# Altium schematic sheet Misaka-v1.0.SchDoc (part 1 of 2)
size 629 x 400 mm
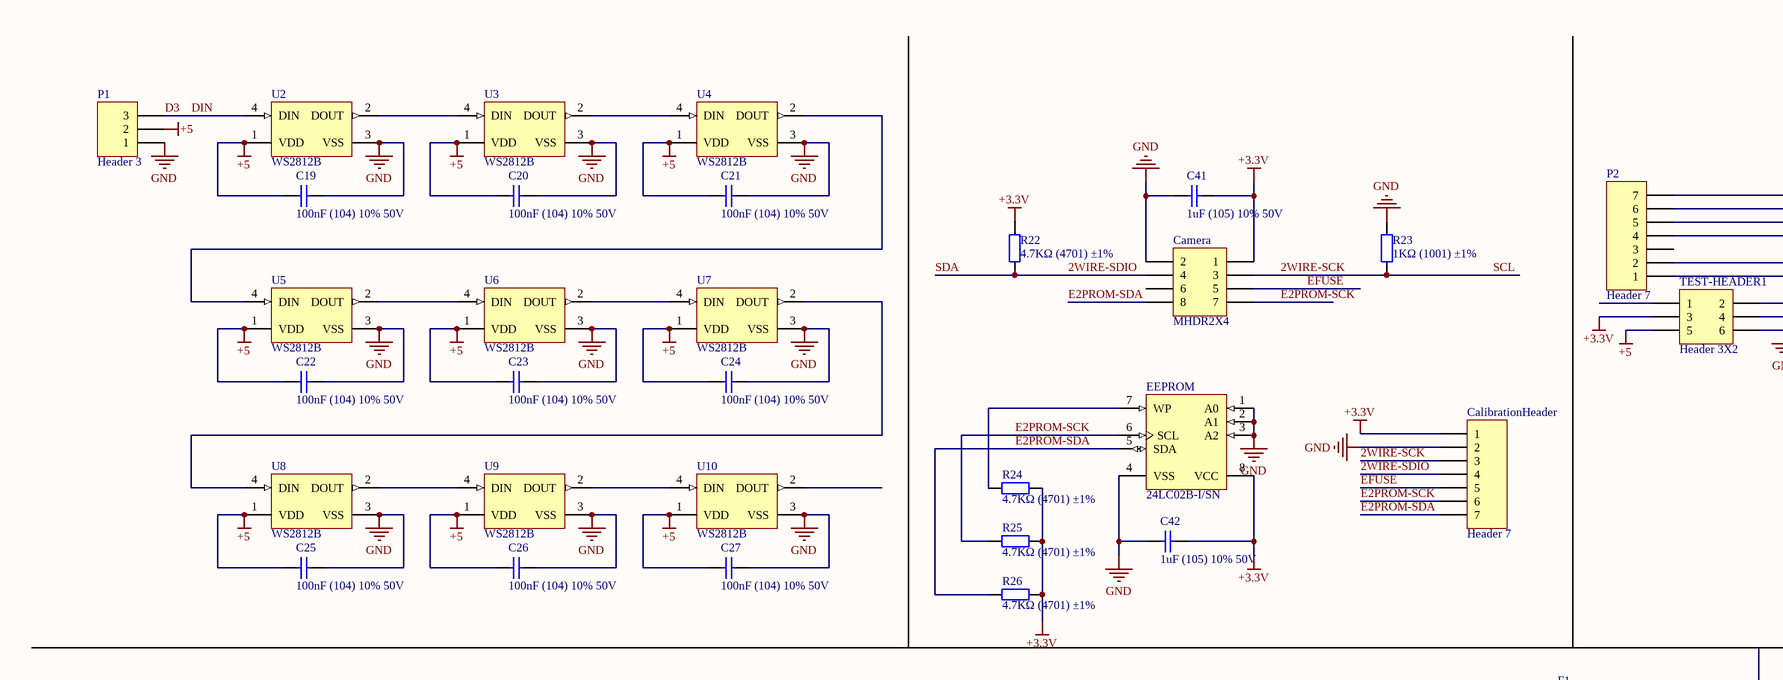
[diagram p0: Misaka-v1.0.SchDoc, top left]
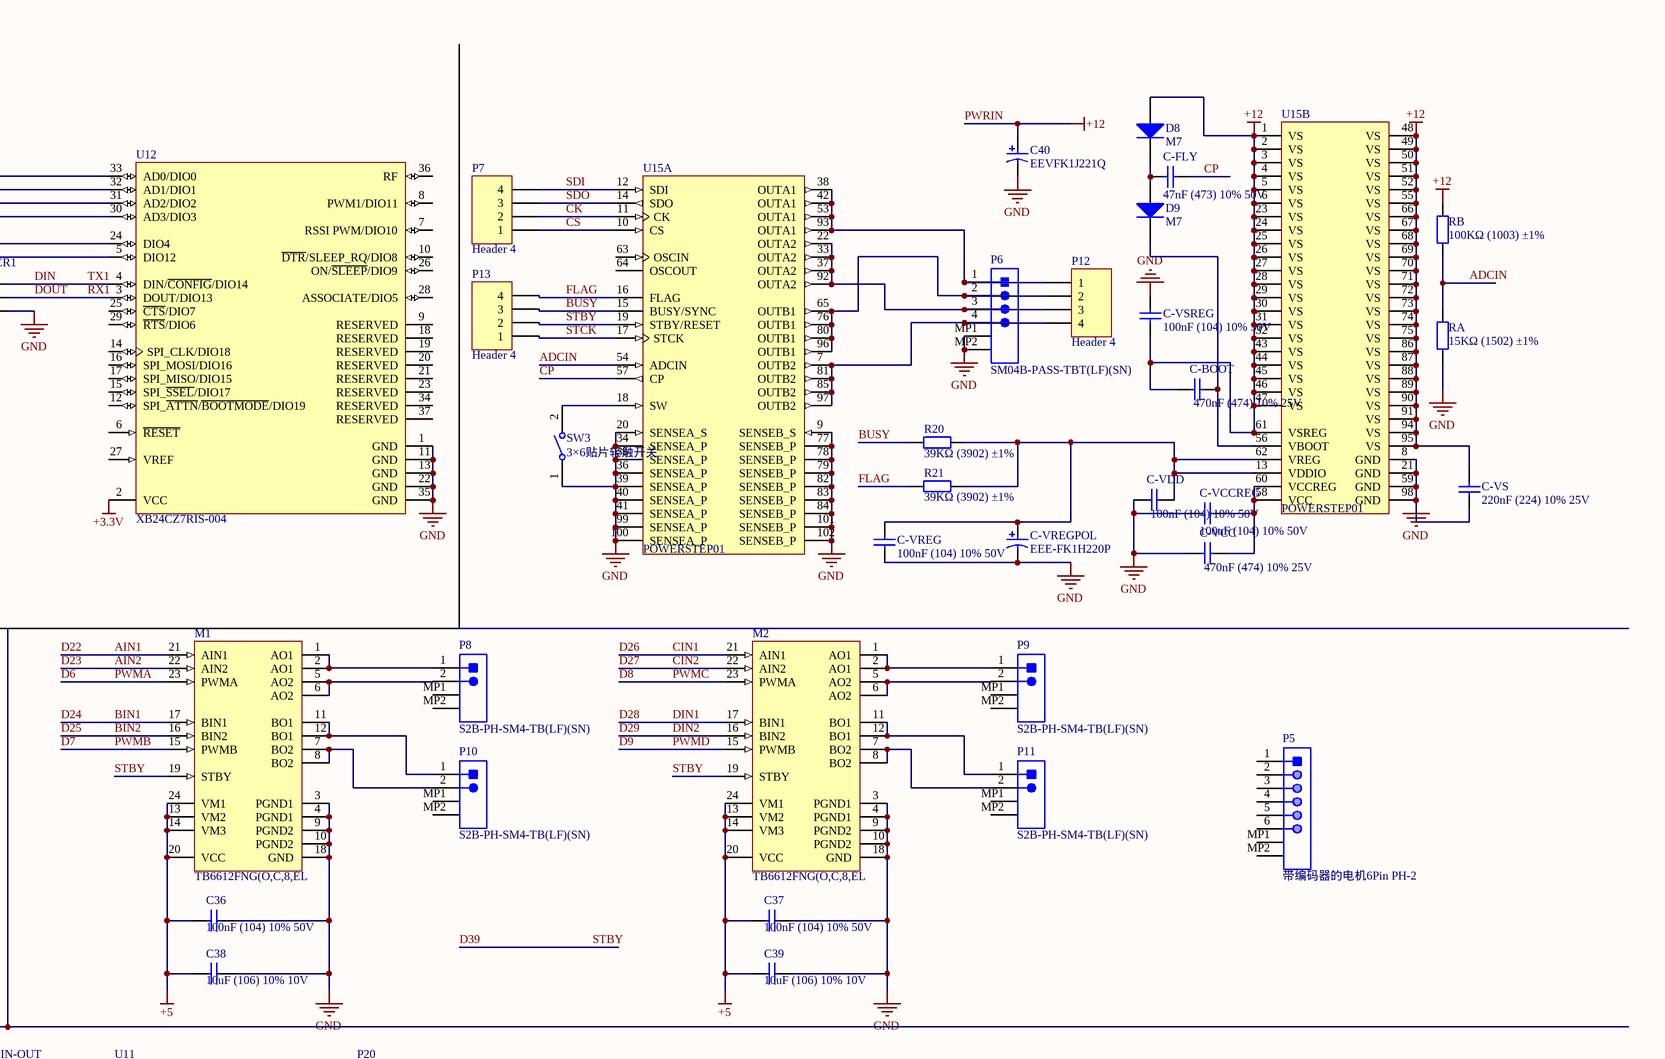
[diagram p1: Misaka-v1.0.SchDoc, top right]
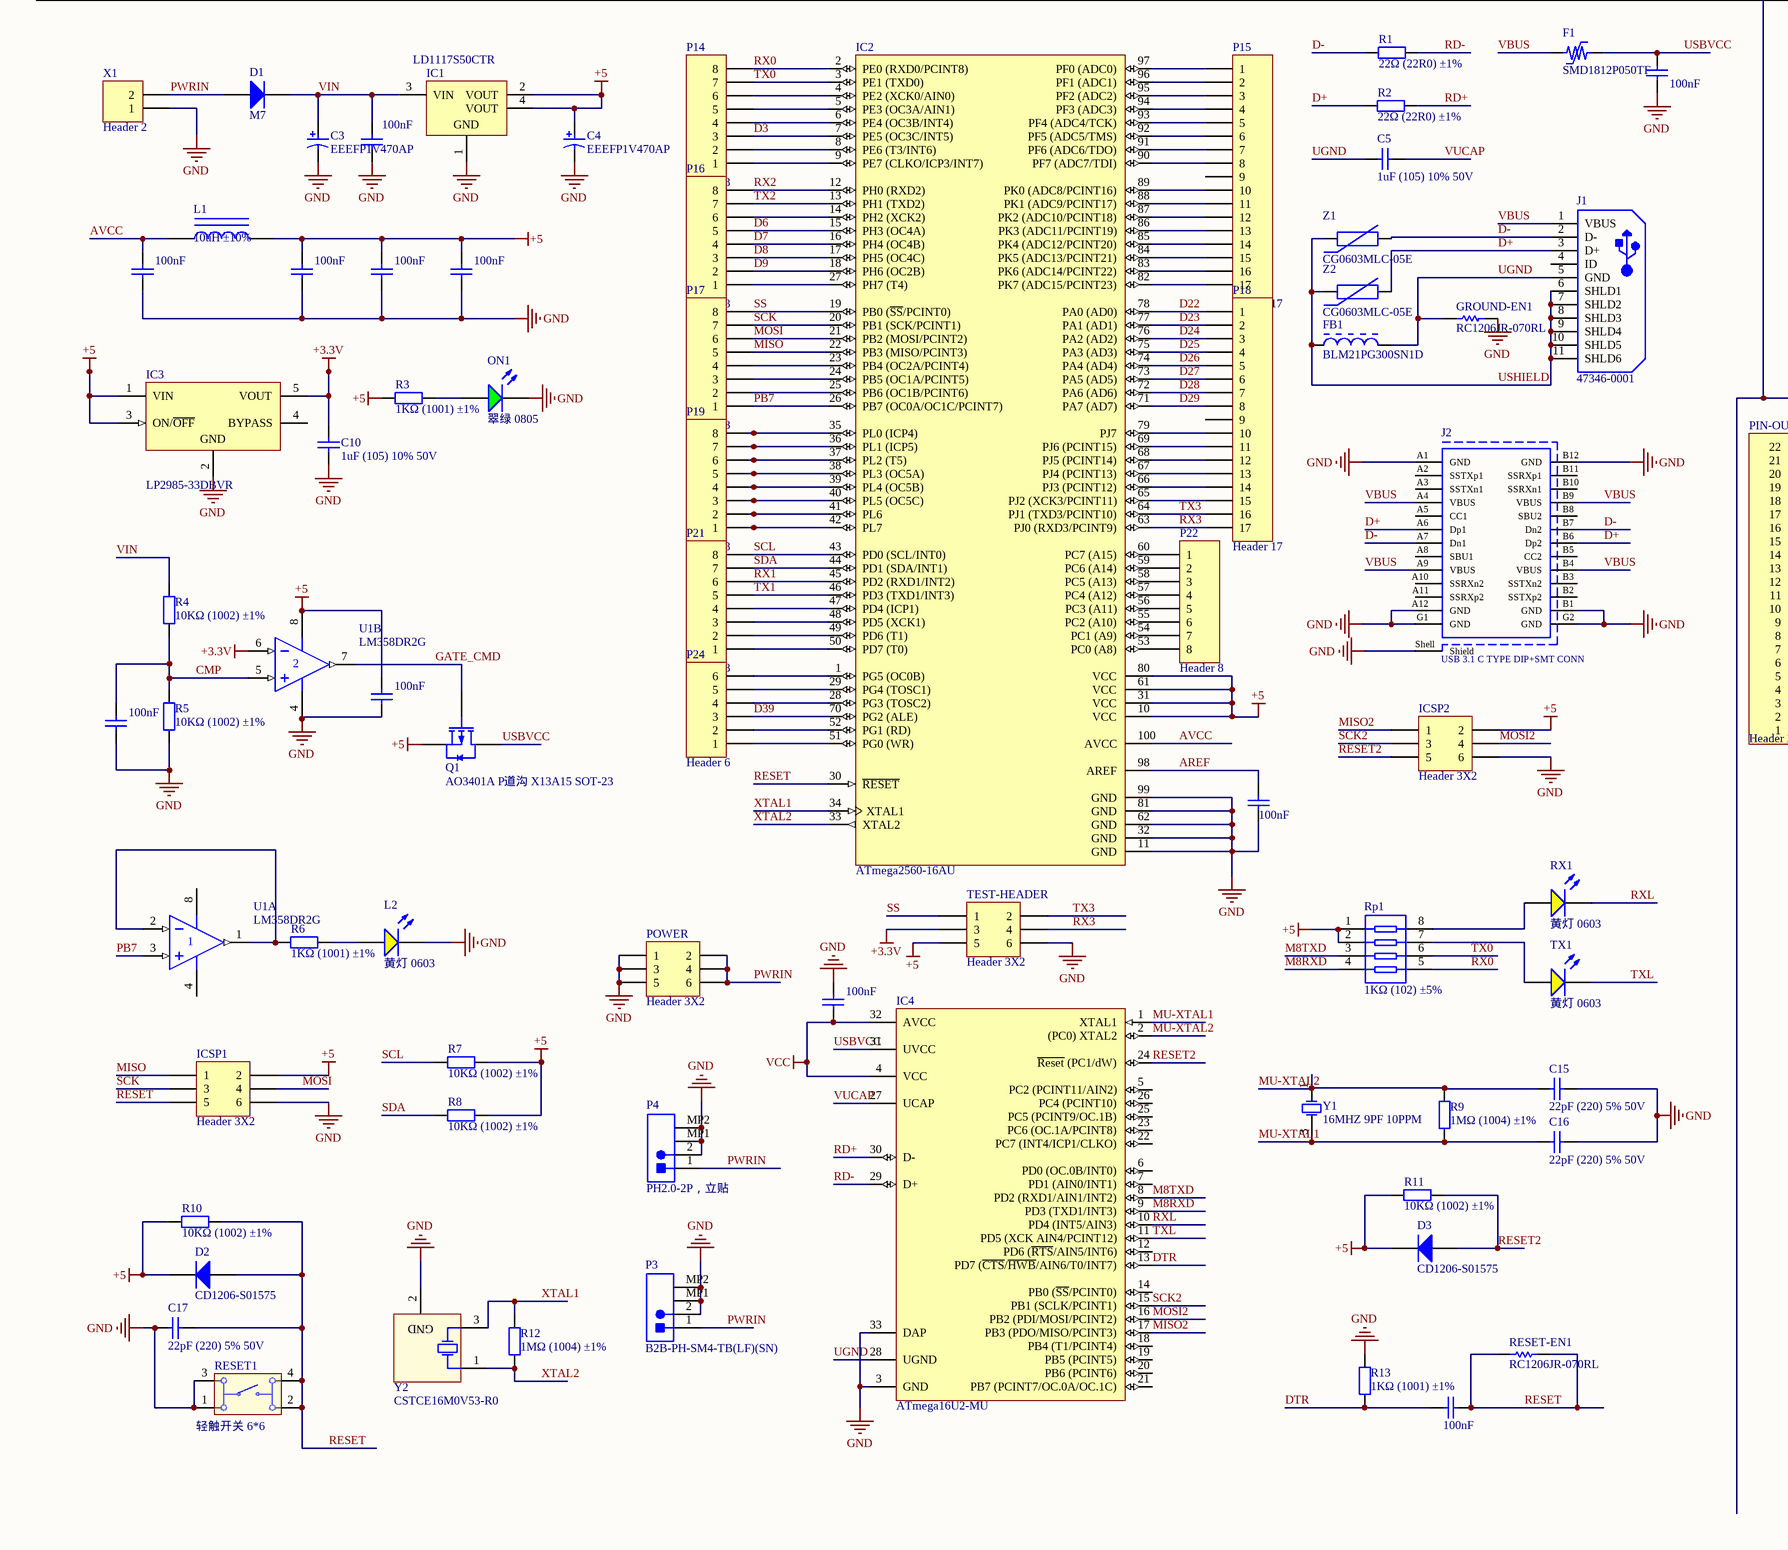
[diagram p2: Misaka-v1.0.SchDoc, bottom left]
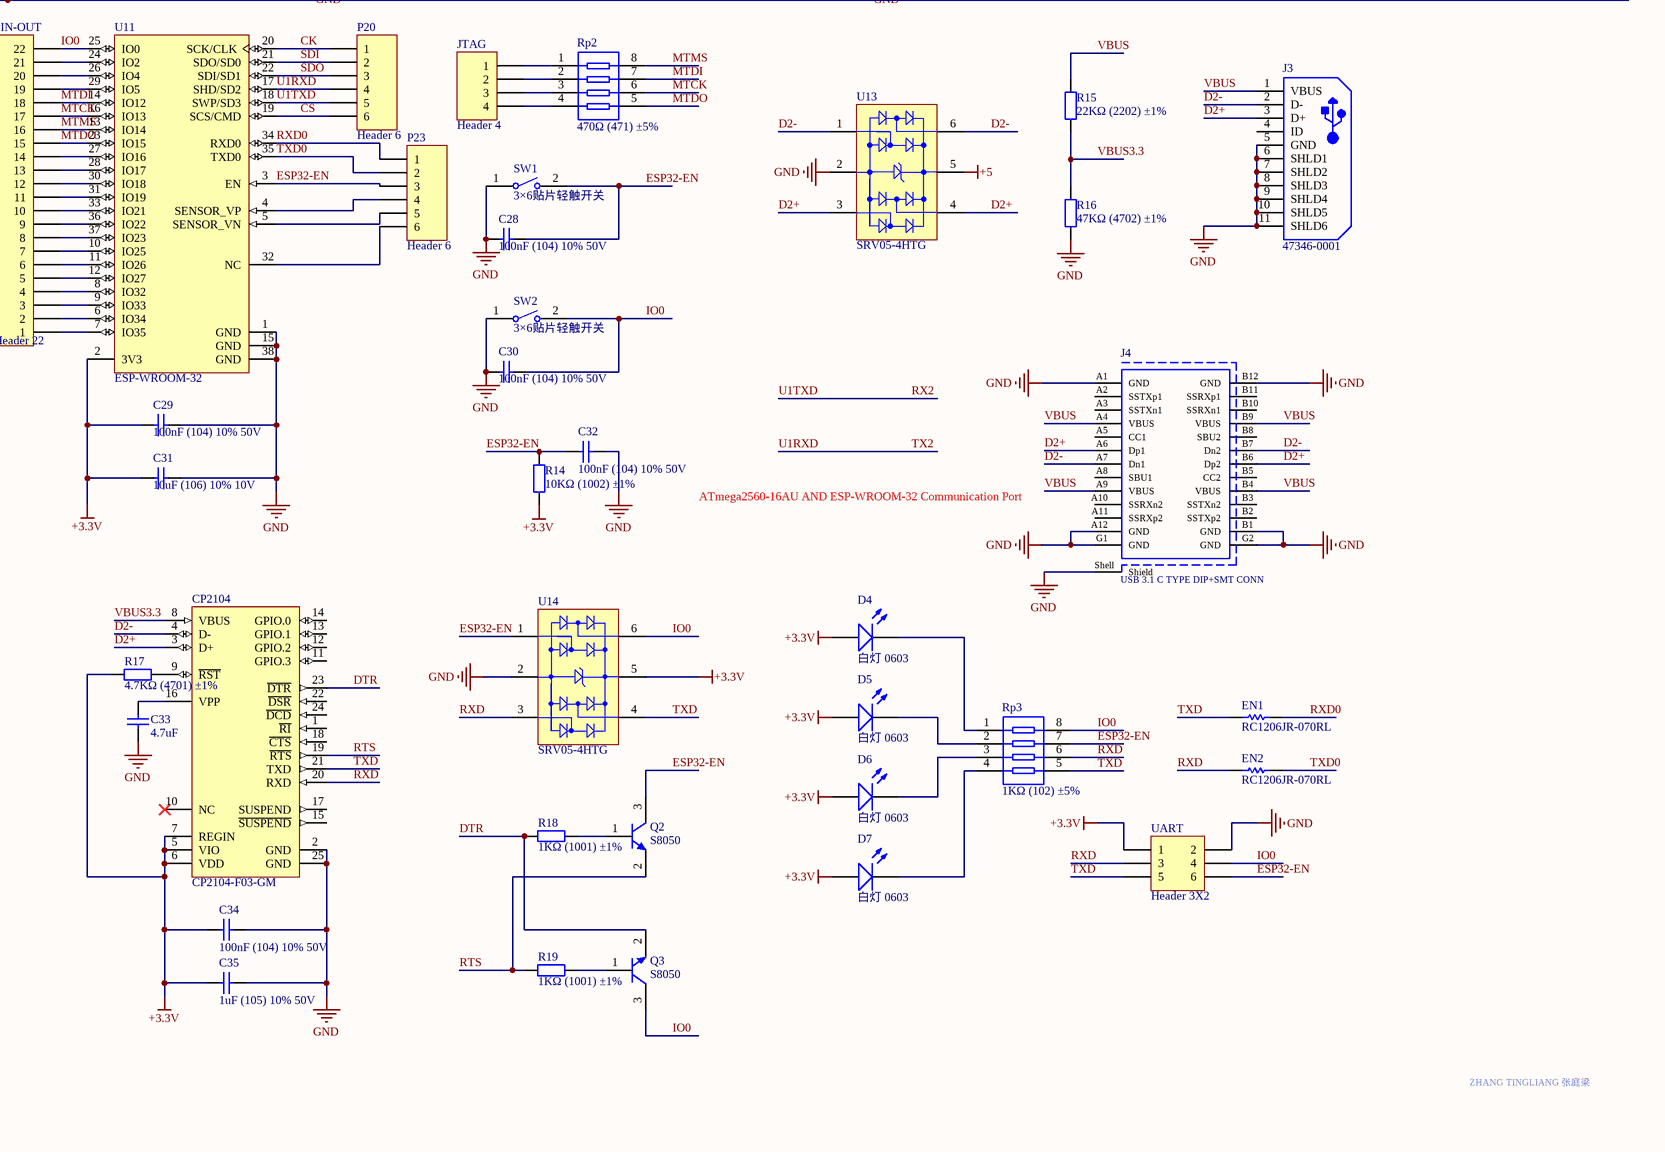
[diagram p3: Misaka-v1.0.SchDoc, bottom right]

## Parts
C1  100nF  [0603_C]
C2  100nF  [0603_C]
C3  EEEFP1V470AP  [PNSC-FP-V-D_V]
C4  EEEFP1V470AP  [PNSC-FP-V-D_V]
C5  1uF (105) 10% 50V  [0603_C]
C6  100nF  [0603_C]
C7  100nF  [0603_C]
C8  100nF  [0603_C]
C9  100nF  [0603_C]
C10  1uF (105) 10% 50V  [0603_C]
C11  100nF  [0603_C]
C12  100nF  [0603_C]
C13  100nF  [0603_C]
C14  100nF  [0603_C]
C15  22pF (220) 5% 50V  [0603_C]
C16  22pF (220) 5% 50V  [0603_C]
C17  22pF (220) 5% 50V  [0603_C]
C18  100nF  [0603_C]
C19  100nF (104) 10% 50V  [0603_C]
C20  100nF (104) 10% 50V  [0603_C]
C21  100nF (104) 10% 50V  [0603_C]
C22  100nF (104) 10% 50V  [0603_C]
C23  100nF (104) 10% 50V  [0603_C]
C24  100nF (104) 10% 50V  [0603_C]
C25  100nF (104) 10% 50V  [0603_C]
C26  100nF (104) 10% 50V  [0603_C]
C27  100nF (104) 10% 50V  [0603_C]
C28  100nF (104) 10% 50V  [0603_C]
C29  100nF (104) 10% 50V  [0603_C]
C30  100nF (104) 10% 50V  [0603_C]
C31  10uF (106) 10% 10V  [0603_C]
C32  100nF (104) 10% 50V  [0603_C]
C33  4.7uF  [0603_C]
C34  100nF (104) 10% 50V  [0603_C]
C35  1uF (105) 10% 50V  [0603_C]
C36  100nF (104) 10% 50V  [0603_C]
C37  100nF (104) 10% 50V  [0603_C]
C38  10uF (106) 10% 10V  [0603_C]
C39  10uF (106) 10% 10V  [0603_C]
C40  EEVFK1J221Q  [PNSC-FK-V-H13_V]
C41  1uF (105) 10% 50V  [0603_C]
C42  1uF (105) 10% 50V  [0603_C]
C-BOOT  470nF (474) 10% 25V  [0603_C]
C-FLY  47nF (473) 10% 50V  [0603_C]
C-VCC  470nF (474) 10% 25V  [0603_C]
C-VCCREG  100nF (104) 10% 50V  [0603_C]
C-VDD  100nF (104) 10% 50V  [0603_C]
C-VREG  100nF (104) 10% 50V  [0603_C]
C-VREGPOL  EEE-FK1H220P  [PNSC-EEE-FK1H220P_L]
C-VS  220nF (224) 10% 25V  [0603_C]
C-VSREG  100nF (104) 10% 50V  [0603_C]
CalibrationHeader  Header 7  [HDR1X7]
Camera  MHDR2X4  [MHDR2X4]
CP2104  CP2104-F03-GM  [SLAB-QFN-24-2675x2675TP_M]
D1  M7  [SMA(DO-214AC)_S1]
D2  CD1206-S01575  [BOUR-CD1206-S01575-2_L]
D3  CD1206-S01575  [BOUR-CD1206-S01575-2_L]
D4  白灯 0603  [0603_LED_S1]
D5  白灯 0603  [0603_LED_S1]
D6  白灯 0603  [0603_LED_S1]
D7  白灯 0603  [0603_LED_S1]
D8  M7  [SMA(DO-214AC)_S1]
D9  M7  [SMA(DO-214AC)_S1]
EEPROM  24LC02B-I/SN  [SOIC-SN8_N]
EN1  RC1206JR-070RL  [RESC3116X65X40ML10T20]
EN2  RC1206JR-070RL  [RESC3116X65X40ML10T20]
F1  SMD1812P050TF  [BOUR-MF-MSMF050-2_V]
FB1  BLM21PG300SN1D  [MURA-BLM21-B40-CHIP-2_V2]
GROUND-EN1  RC1206JR-070RL  [RESC3116X65X40ML10T20]
IC1  LD1117S50CTR  [SOT-223_N]
IC2  ATmega2560-16AU  [100A_M]
IC3  LP2985-33DBVR  [DBV0005A_M]
IC4  ATmega16U2-MU  [32PG_N]
ICSP1  Header 3X2  [HDR2X3]
ICSP2  Header 3X2  [HDR2X3]
J1  47346-0001  [MOLX-47346-0001-5_V]
J2  USB 3.1 C TYPE DIP+SMT CONN  [632723100011]
J3  47346-0001  [MOLX-47346-0001-5_V]
J4  USB 3.1 C TYPE DIP+SMT CONN  [632723100011]
JTAG  Header 4  [HDR1X4]
L1  10uH ±10%  [0603_L]
L2  黄灯 0603  [0603_LED_S1]
M1  TB6612FNG(O,C,8,EL  [TOSH-SSOP24-P-300-0.65A_M]
M2  TB6612FNG(O,C,8,EL  [TOSH-SSOP24-P-300-0.65A_M]
ON1  翠绿 0805  [0805_LED_S1]
P1  Header 3  [HDR1X3]
P2  Header 7  [HDR1X7]
P3  B2B-PH-SM4-TB(LF)(SN)  [JST-B2B-PH-SM4-TB-2_V]
P4  PH2.0-2P，立贴  [JST-B2B-PH-SM4-TB-2_V]
P5  带编码器的电机6Pin PH-2  [JST-S6B-PH-SM4-TB(LF)(SN)_V]
P6  SM04B-PASS-TBT(LF)(SN)  [JST-SM04B-PASS-TBT(LF)(SN)_V]
P7  Header 4  [HDR1X4]
P8  S2B-PH-SM4-TB(LF)(SN)  [JST- S2B-PH-SM4-TB(LF)(SN)-2_V]
P9  S2B-PH-SM4-TB(LF)(SN)  [JST- S2B-PH-SM4-TB(LF)(SN)-2_V]
P10  S2B-PH-SM4-TB(LF)(SN)  [JST- S2B-PH-SM4-TB(LF)(SN)-2_V]
P11  S2B-PH-SM4-TB(LF)(SN)  [JST- S2B-PH-SM4-TB(LF)(SN)-2_V]
P12  Header 4  [HDR1X4]
P13  Header 4  [HDR1X4]
P14  Header 8  [HDR1X8]
P15  Header 17  [HDR1X17]
P16  Header 8  [HDR1X8]
P17  Header 8  [HDR1X8]
P18  Header 17  [HDR1X17]
P19  Header 8  [HDR1X8]
P20  Header 6  [HDR1X6]
P21  Header 8  [HDR1X8]
P22  Header 8  [HDR1X8]
P23  Header 6  [HDR1X6]
P24  Header 6  [HDR1X6]
PIN-OUT  Header 22  [HDR1X22]
POWER  Header 3X2  [HDR2X3]
Q1  AO3401A P道沟 X13A15 SOT-23  [SOT-23-3L]
Q2  S8050  [ONSC-SOT-23-3-318-08_V]
Q3  S8050  [ONSC-SOT-23-3-318-08_V]
R1  22Ω (22R0) ±1%  [0603_R]
R2  22Ω (22R0) ±1%  [0603_R]
R3  1KΩ (1001) ±1%  [0603_R]
R4  10KΩ (1002) ±1%  [0603_R]
R5  10KΩ (1002) ±1%  [0603_R]
R6  1KΩ (1001) ±1%  [0603_R]
R7  10KΩ (1002) ±1%  [0603_R]
R8  10KΩ (1002) ±1%  [0603_R]
R9  1MΩ (1004) ±1%  [0603_R]
R10  10KΩ (1002) ±1%  [0603_R]
R11  10KΩ (1002) ±1%  [0603_R]
R12  1MΩ (1004) ±1%  [0603_R]
R13  1KΩ (1001) ±1%  [0603_R]
R14  10KΩ (1002) ±1%  [0603_R]
R15  22KΩ (2202) ±1%  [0603_R]
R16  47KΩ (4702) ±1%  [0603_R]
R17  4.7KΩ (4701) ±1%  [0603_R]
R18  1KΩ (1001) ±1%  [0603_R]
R19  1KΩ (1001) ±1%  [0603_R]
R20  39KΩ (3902) ±1%  [0603_R]
R21  39KΩ (3902) ±1%  [0603_R]
R22  4.7KΩ (4701) ±1%  [0603_R]
R23  1KΩ (1001) ±1%  [0603_R]
R24  4.7KΩ (4701) ±1%  [0603_R]
R25  4.7KΩ (4701) ±1%  [0603_R]
R26  4.7KΩ (4701) ±1%  [0603_R]
RA  15KΩ (1502) ±1%  [0603_R]
RB  100KΩ (1003) ±1%  [0603_R]
RESET1  轻触开关 6*6  [430152043836]
RESET-EN1  RC1206JR-070RL  [RESC3116X65X40ML10T20]
Rp1  1KΩ (102) ±5%  [0603_Rx4]
Rp2  470Ω (471) ±5%  [0603_Rx4]
Rp3  1KΩ (102) ±5%  [0603_Rx4]
RX1  黄灯 0603  [0603_LED_S1]
SW1  3×6贴片轻触开关  [TECO-FSMSM-2_V]
SW2  3×6贴片轻触开关  [TECO-FSMSM-2_V]
SW3  3×6贴片轻触开关  [TECO-FSMSM-2_V]
TEST-HEADER  Header 3X2  [HDR2X3]
TEST-HEADER1  Header 3X2  [HDR2X3]
TX1  黄灯 0603  [0603_LED_S1]
U1  LM358DR2G  [SOIC-8_150mil]  (parts A,B of 2)
U2  WS2812B  [ADA-RGB-1655_V]
U3  WS2812B  [ADA-RGB-1655_V]
U4  WS2812B  [ADA-RGB-1655_V]
U5  WS2812B  [ADA-RGB-1655_V]
U6  WS2812B  [ADA-RGB-1655_V]
U7  WS2812B  [ADA-RGB-1655_V]
U8  WS2812B  [ADA-RGB-1655_V]
U9  WS2812B  [ADA-RGB-1655_V]
U10  WS2812B  [ADA-RGB-1655_V]
U11  ESP-WROOM-32  [OLMX-ESP-WROOM-32]
U12  XB24CZ7RIS-004  [DIGI-XB24CZ7RIS-004-Module-37_V]
U13  SRV05-4HTG  [LFUS-SOT23-6_V]
U14  SRV05-4HTG  [LFUS-SOT23-6_V]
U15  POWERSTEP01  [STM-VFQFPN-102_V]  (parts A,B of 2)
UART  Header 3X2  [HDR2X3]
X1  Header 2  [HDR1X2]
Y1  16MHZ 9PF 10PPM  [SMD-3225_4P]
Y2  CSTCE16M0V53-R0  [MURA-CSTCE_V-3_V]
Z1  CG0603MLC-05E  [BOUR-CG0603-2_V]
Z2  CG0603MLC-05E  [BOUR-CG0603-2_V]

## Nets
+3.3V: C10.2 C29.1 C31.1 C34.1 C35.1 C41.2 C42.2 CalibrationHeader.1 Camera.1 CP2104.5(VIO) CP2104.6(VDD) CP2104.7(REGIN) D4.A D5.A D6.A D7.A EEPROM.8(VCC) IC3.5(VOUT) R14.1 R17.2 R22.2 R24.2 R25.2 R26.2 TEST-HEADER.3 TEST-HEADER1.3 U1.6(IN-) U11.2(3V3) U12.2(VCC) U14.5(VCC) UART.1
+5: C4.1 C7.1 C8.1 C9.1 C11.1 C19.1 C20.1 C21.1 C22.1 C23.1 C24.1 C25.1 C26.1 C27.1 C36.1 C37.1 C38.1 C39.1 D2.2(K) D3.2(K) IC1.2(VOUT) IC1.4(VOUT) IC2.10(VCC) IC2.31(VCC) IC2.61(VCC) IC2.80(VCC) IC3.1(VIN) IC3.3(ON/~{OFF}) ICSP1.2 ICSP2.2 L1.2 M1.13(VM2) M1.14(VM3) M1.20(VCC) M1.24(VM1) M2.13(VM2) M2.14(VM3) M2.20(VCC) M2.24(VM1) P1.2 Q1.2(S) R3.1 R7.1 R8.1 R10.2 R11.2 Rp1.1 Rp1.2 TEST-HEADER.5 TEST-HEADER1.5 U1.8(V+) U2.1(VDD) U3.1(VDD) U4.1(VDD) U5.1(VDD) U6.1(VDD) U7.1(VDD) U8.1(VDD) U9.1(VDD) U10.1(VDD) U13.5(VCC)
GND: C1.1 C2.2 C3.2 C4.2 C6.2 C7.2 C8.2 C9.2 C10.1 C11.2 C12.2 C13.2 C14.1 C15.1 C16.2 C17.1 C19.2 C20.2 C21.2 C22.2 C23.2 C24.2 C25.2 C26.2 C27.2 C28.1 C29.2 C30.1 C31.2 C32.2 C33.1 C34.2 C35.2 C36.2 C37.2 C38.2 C39.2 C40.2 C41.1 C42.1 C-VCC.1 C-VCCREG.1 C-VDD.1 C-VREG.1 C-VREGPOL.2 C-VS.1 C-VSREG.2 CalibrationHeader.2 Camera.2 CP2104.2(GND) CP2104.25(GND) EEPROM.1(A0) EEPROM.2(A1) EEPROM.3(A2) EEPROM.4(VSS) GROUND-EN1.2 IC1.1(GND) IC2.11(GND) IC2.32(GND) IC2.62(GND) IC2.81(GND) IC2.99(GND) IC3.2(GND) IC4.3(GND) IC4.33(DAP) ICSP1.6 ICSP2.6 J2.A1(GND) J2.A12(GND) J2.B1(GND) J2.B12(GND) J2.G1(GND) J2.G2(GND) J2.Shell(Shield) J3.5(GND) J3.6(SHLD1) J3.7(SHLD2) J3.8(SHLD3) J3.9(SHLD4) J3.10(SHLD5) J3.11(SHLD6) J4.A1(GND) J4.A12(GND) J4.B1(GND) J4.B12(GND) J4.G1(GND) J4.G2(GND) J4.Shell(Shield) L2.K M1.3(PGND1) M1.4(PGND1) M1.9(PGND2) M1.10(PGND2) M1.18(GND) M2.3(PGND1) M2.4(PGND1) M2.9(PGND2) M2.10(PGND2) M2.18(GND) ON1.K P1.1 P3.2 P3.MP1 P3.MP2 P4.2 P4.MP1 P4.MP2 P6.MP1 P6.MP2 POWER.1 POWER.3 POWER.5 R5.1 R13.1 R16.1 R23.2 RA.1 RESET1.1 RESET1.3 SW1.1 SW2.1 SW3.1 TEST-HEADER.6 TEST-HEADER1.6 U1.4(V-) U2.3(VSS) U3.3(VSS) U4.3(VSS) U5.3(VSS) U6.3(VSS) U7.3(VSS) U8.3(VSS) U9.3(VSS) U10.3(VSS) U11.1(GND) U11.15(GND) U11.38(GND) U12.1(GND) U12.11(GND) U12.13(GND) U12.22(GND) U12.35(GND) U13.2(GND) U14.2(GND) U15.8(GND) U15.9(SENSEB_S) U15.20(SENSEA_S) U15.21(GND) U15.34(SENSEA_P) U15.35(SENSEA_P) U15.36(SENSEA_P) U15.39(SENSEA_P) U15.40(SENSEA_P) U15.41(SENSEA_P) U15.59(GND) U15.77(SENSEB_P) U15.78(SENSEB_P) U15.79(SENSEB_P) U15.82(SENSEB_P) U15.83(SENSEB_P) U15.84(SENSEB_P) U15.98(GND) U15.99(SENSEA_P) U15.100(SENSEA_P) U15.101(SENSEB_P) U15.102(SENSEB_P) UART.2 X1.1 Y2.2(GND)
PWRIN: C40.1 C-BOOT.1 C-VS.2 C-VSREG.1 D1.1(A) D8.1(A) P3.1 P4.1 POWER.2 POWER.4 POWER.6 RB.2 U15.1(VS) U15.2(VS) U15.3(VS) U15.4(VS) U15.5(VS) U15.6(VS) U15.23(VS) U15.24(VS) U15.25(VS) U15.26(VS) U15.27(VS) U15.28(VS) U15.29(VS) U15.30(VS) U15.31(VS) U15.32(VS) U15.43(VS) U15.44(VS) U15.45(VS) U15.46(VS) U15.47(VS) U15.48(VS) U15.49(VS) U15.50(VS) U15.51(VS) U15.52(VS) U15.55(VS) U15.61(VSREG) U15.66(VS) U15.67(VS) U15.68(VS) U15.69(VS) U15.70(VS) U15.71(VS) U15.72(VS) U15.73(VS) U15.74(VS) U15.75(VS) U15.86(VS) U15.87(VS) U15.88(VS) U15.89(VS) U15.90(VS) U15.91(VS) U15.94(VS) U15.95(VS) X1.2  [also labelled +12]
VCC: C14.2 IC4.4(VCC) IC4.32(AVCC)
2WIRE-SCK: CalibrationHeader.3 Camera.3 IC2.43(PD0_(SCL/INT0)) P21.8 R7.2 R23.1  [also labelled SCL]
2WIRE-SDIO: CalibrationHeader.4 Camera.4 IC2.44(PD1_(SDA/INT1)) P21.7 R8.2 R22.1  [also labelled SDA]
ADCIN: RA.2 RB.1 U15.54(ADCIN)
AIN1: IC2.78(PA0_(AD0)) M1.21(AIN1) P18.1  [also labelled D22]
AIN2: IC2.77(PA1_(AD1)) M1.22(AIN2) P18.2  [also labelled D23]
AREF: C13.1 IC2.98(AREF)
AVCC: C6.1 IC2.100(AVCC) L1.1
BIN1: IC2.76(PA2_(AD2)) M1.17(BIN1) P18.3  [also labelled D24]
BIN2: IC2.75(PA3_(AD3)) M1.16(BIN2) P18.4  [also labelled D25]
BUSY: P13.3 R20.1 U15.15(BUSY/SYNC)
CIN1: IC2.74(PA4_(AD4)) M2.21(AIN1) P18.5  [also labelled D26]
CIN2: IC2.73(PA5_(AD5)) M2.22(AIN2) P18.6  [also labelled D27]
CK: P7.2 P20.1 U11.20(SCK/CLK) U15.11(CK)
CMP: C12.1 R4.1 R5.2 U1.5(IN+)
CP: C-FLY.2 U15.57(CP)
CS: P7.1 P20.6 U11.19(SCS/CMD) U15.10(CS)
D2+: CP2104.3(D+) J3.3(D+) J4.A6(Dp1) J4.B6(Dp2) U13.3(I/O_2) U13.4(I/O_3)
D2-: CP2104.4(D-) J3.2(D-) J4.A7(Dn1) J4.B7(Dn2) U13.1(I/O_1) U13.6(I/O_4)
D3: IC2.7(PE5_(OC3C/INT5)) IC2.46(PD3_(TXD1/INT3)) P1.3 P14.3 P21.5 TEST-HEADER1.2 U2.4(DIN) U12.4(DIN/~{CONFIG}/DIO14)  [also labelled DIN, TX1]
D6: IC2.15(PH3_(OC4A)) M1.23(PWMA) P16.5  [also labelled PWMA]
D7: IC2.16(PH4_(OC4B)) M1.15(PWMB) P16.4  [also labelled PWMB]
D8: IC2.17(PH5_(OC4C)) M2.23(PWMA) P16.3  [also labelled PWMC]
D9: IC2.18(PH6_(OC2B)) M2.15(PWMB) P16.2  [also labelled PWMD]
D28: IC2.72(PA6_(AD6)) M2.17(BIN1) P18.7  [also labelled DIN1]
D29: IC2.71(PA7_(AD7)) M2.16(BIN2) P18.8  [also labelled DIN2]
D39: IC2.70(PG2_(ALE)) M1.19(STBY) M2.19(STBY) P13.2 P24.3 U15.19(STBY/RESET)  [also labelled STBY]
D+: J1.3(D+) J2.A6(Dp1) J2.B6(Dp2) R2.1 Z2.2
D-: J1.2(D-) J2.A7(Dn1) J2.B7(Dn2) R1.1 Z1.2
DOUT: IC2.45(PD2_(RXD1/INT2)) P21.6 TEST-HEADER1.4 U12.3(DOUT/DIO13)  [also labelled RX1]
DTR: C18.1 CP2104.23(~{DTR}) IC4.13(PD7_(~{CTS}/~{HWB}/AIN6/T0/INT7)) Q3.2(E) R13.2 R18.1
E2PROM-SCK: CalibrationHeader.6 Camera.7 EEPROM.6(SCL) R25.1
E2PROM-SDA: CalibrationHeader.7 Camera.8 EEPROM.5(SDA) R26.1
EFUSE: CalibrationHeader.5 Camera.5
ESP32-EN: C28.2 C32.1 P23.3 Q2.3(C) R14.2 Rp3.7 SW1.2 U11.3(EN) U14.1(I/O_1) UART.6
FLAG: P13.4 R21.1 U15.16(FLAG)
GATE_CMD: Q1.1(G) U1.7(OUT)
IO0: C30.2 PIN-OUT.22 Q3.3(C) Rp3.8 SW2.2 U11.25(IO0) U14.6(I/O_4) UART.4
M8RXD: IC4.9(PD3_(TXD1/INT3)) Rp1.4
M8TXD: IC4.8(PD2_(RXD1/AIN1/INT2)) Rp1.3
MISO: IC2.22(PB3_(MISO/PCINT3)) ICSP1.1 P17.5
MISO2: IC4.17(PB3_(PDO/MISO/PCINT3)) ICSP2.1
MOSI: IC2.21(PB2_(MOSI/PCINT2)) ICSP1.4 P17.6
MOSI2: IC4.16(PB2_(PDI/MOSI/PCINT2)) ICSP2.4
MTCK: PIN-OUT.17 Rp2.6 U11.16(IO13)
MTDI: PIN-OUT.18 Rp2.7 U11.14(IO12)
MTDO: PIN-OUT.15 Rp2.5 U11.23(IO15)
MTMS: PIN-OUT.16 Rp2.8 U11.13(IO14)
MU-XTAL1: C16.1 IC4.1(XTAL1) R9.2 Y1.3(OSC2)
MU-XTAL2: C15.2 IC4.2((PC0)_XTAL2) R9.1 Y1.1(OSC1)
PB7: IC2.26(PB7_(OC0A/OC1C/PCINT7)) P17.1 U1.3(IN+)
RD+: IC4.30(D-) R2.2
RD-: IC4.29(D+) R1.2
RESET: C17.2 C18.2 D2.1(A) IC2.30(~{RESET}) ICSP1.5 R10.1 RESET1.2 RESET1.4 RESET-EN1.1 RESET-EN1.2
RESET2: D3.1(A) IC4.24(~{Reset}_(PC1/dW)) ICSP2.5 R11.1
RTS: CP2104.19(~{RTS}) Q2.2(E) R19.1
RX0: IC2.2(PE0_(RXD0/PCINT8)) P14.8 Rp1.5
RX2: IC2.12(PH0_(RXD2)) P16.8 P20.5 U11.18(SWP/SD3)  [also labelled U1TXD]
RX3: IC2.63(PJ0_(RXD3/PCINT9)) P18.17 TEST-HEADER.4
RXD: CP2104.20(RXD) EN2.1 Rp3.6 U14.3(I/O_2) UART.3
RXD0: EN1.2 P23.1 U11.34(RXD0)
RXL: IC4.10(PD4_(INT5/AIN3)) RX1.K
SCK: IC2.20(PB1_(SCK/PCINT1)) ICSP1.3 P17.7
SCK2: IC4.15(PB1_(SCLK/PCINT1)) ICSP2.3
SDI: P7.4 P20.2 U11.21(SDO/SD0) U15.12(SDI)
SDO: P7.3 P20.3 U11.22(SDI/SD1) U15.14(SDO)
SS: IC2.19(PB0_(~{SS}/PCINT0)) P17.8 TEST-HEADER.1
STCK: P13.1 U15.17(STCK)
TX0: IC2.3(PE1_(TXD0)) P14.7 Rp1.6
TX2: IC2.13(PH1_(TXD2)) P16.7 P20.4 U11.17(SHD/SD2)  [also labelled U1RXD]
TX3: IC2.64(PJ1_(TXD3/PCINT10)) P18.16 TEST-HEADER.2
TXD: CP2104.21(TXD) EN1.1 Rp3.5 U14.4(I/O_3) UART.5
TXD0: EN2.2 P23.2 U11.35(TXD0)
TXL: IC4.11(PD5_(XCK_AIN4/PCINT12)) TX1.K
UGND: C5.2 FB1.2 GROUND-EN1.1 IC4.28(UGND) J1.5(GND)
USBVCC: C1.2 F1.2 IC4.31(UVCC) Q1.3(D)
USHIELD: FB1.1 J1.6(SHLD1) J1.7(SHLD2) J1.8(SHLD3) J1.9(SHLD4) J1.10(SHLD5) J1.11(SHLD6) Z1.1 Z2.1
VBUS: F1.1 J1.1(VBUS) J2.A4(VBUS) J2.A9(VBUS) J2.B4(VBUS) J2.B9(VBUS) J3.1(VBUS) J4.A4(VBUS) J4.A9(VBUS) J4.B4(VBUS) J4.B9(VBUS) R15.2
VBUS3.3: CP2104.8(VBUS) R15.1 R16.2
VIN: C2.1 C3.1 D1.2(K) IC1.3(VIN) R4.2
VUCAP: C5.1 IC4.27(UCAP)
XTAL1: IC2.34(XTAL1) R12.2 Y2.3(C2)
XTAL2: IC2.33(XTAL2) R12.1 Y2.1(C1)
NetC33_2: C33.2 CP2104.16(VPP)
NetC-BOOT_2: C-BOOT.2 D9.2(K) U15.56(VBOOT)
NetC-FLY_1: C-FLY.1 D8.2(K) D9.1(A)
NetC-VCC_2: C-VCC.2 C-VCCREG.2 U15.58(VCC) U15.60(VCCREG)
NetC-VDD_2: C-VDD.2 C-VREG.2 C-VREGPOL.1 R20.2 R21.2 U15.13(VDDIO) U15.62(VREG)
NetCP2104_9: CP2104.9(~{RST}) R17.1
NetD4_K: D4.K Rp3.1
NetD5_K: D5.K Rp3.2
NetD6_K: D6.K Rp3.3
NetD7_K: D7.K Rp3.4
NetEEPROM_7: EEPROM.7(WP) R24.1
NetIC2_1: IC2.1(PG5_(OC0B)) P24.6
NetIC2_4: IC2.4(PE2_(XCK0/AIN0)) P14.6
NetIC2_5: IC2.5(PE3_(OC3A/AIN1)) P14.5
NetIC2_6: IC2.6(PE4_(OC3B/INT4)) P14.4
NetIC2_8: IC2.8(PE6_(T3/INT6)) P14.2
NetIC2_9: IC2.9(PE7_(CLKO/ICP3/INT7)) P14.1
NetIC2_14: IC2.14(PH2_(XCK2)) P16.6
NetIC2_23: IC2.23(PB4_(OC2A/PCINT4)) P17.4
NetIC2_24: IC2.24(PB5_(OC1A/PCINT5)) P17.3
NetIC2_25: IC2.25(PB6_(OC1B/PCINT6)) P17.2
NetIC2_27: IC2.27(PH7_(T4)) P16.1
NetIC2_28: IC2.28(PG3_(TOSC2)) P24.4
NetIC2_29: IC2.29(PG4_(TOSC1)) P24.5
NetIC2_35: IC2.35(PL0_(ICP4)) P19.8
NetIC2_36: IC2.36(PL1_(ICP5)) P19.7
NetIC2_37: IC2.37(PL2_(T5)) P19.6
NetIC2_38: IC2.38(PL3_(OC5A)) P19.5
NetIC2_39: IC2.39(PL4_(OC5B)) P19.4
NetIC2_40: IC2.40(PL5_(OC5C)) P19.3
NetIC2_41: IC2.41(PL6) P19.2
NetIC2_42: IC2.42(PL7) P19.1
NetIC2_47: IC2.47(PD4_(ICP1)) P21.4
NetIC2_48: IC2.48(PD5_(XCK1)) P21.3
NetIC2_49: IC2.49(PD6_(T1)) P21.2
NetIC2_50: IC2.50(PD7_(T0)) P21.1
NetIC2_51: IC2.51(PG0_(WR)) P24.1
NetIC2_52: IC2.52(PG1_(RD)) P24.2
NetIC2_53: IC2.53(PC0_(A8)) P22.8
NetIC2_54: IC2.54(PC1_(A9)) P22.7
NetIC2_55: IC2.55(PC2_(A10)) P22.6
NetIC2_56: IC2.56(PC3_(A11)) P22.5
NetIC2_57: IC2.57(PC4_(A12)) P22.4
NetIC2_58: IC2.58(PC5_(A13)) P22.3
NetIC2_59: IC2.59(PC6_(A14)) P22.2
NetIC2_60: IC2.60(PC7_(A15)) P22.1
NetIC2_65: IC2.65(PJ2_(XCK3/PCINT11)) P18.15
NetIC2_66: IC2.66(PJ3_(PCINT12)) P18.14
NetIC2_67: IC2.67(PJ4_(PCINT13)) P18.13
NetIC2_68: IC2.68(PJ5_(PCINT14)) P18.12
NetIC2_69: IC2.69(PJ6_(PCINT15)) P18.11
NetIC2_79: IC2.79(PJ7) P18.10
NetIC2_82: IC2.82(PK7_(ADC15/PCINT23)) P15.17
NetIC2_83: IC2.83(PK6_(ADC14/PCINT22)) P15.16
NetIC2_84: IC2.84(PK5_(ADC13/PCINT21)) P15.15
NetIC2_85: IC2.85(PK4_(ADC12/PCINT20)) P15.14
NetIC2_86: IC2.86(PK3_(ADC11/PCINT19)) P15.13
NetIC2_87: IC2.87(PK2_(ADC10/PCINT18)) P15.12
NetIC2_88: IC2.88(PK1_(ADC9/PCINT17)) P15.11
NetIC2_89: IC2.89(PK0_(ADC8/PCINT16)) P15.10
NetIC2_90: IC2.90(PF7_(ADC7/TDI)) P15.8
NetIC2_91: IC2.91(PF6_(ADC6/TDO)) P15.7
NetIC2_92: IC2.92(PF5_(ADC5/TMS)) P15.6
NetIC2_93: IC2.93(PF4_(ADC4/TCK)) P15.5
NetIC2_94: IC2.94(PF3_(ADC3)) P15.4
NetIC2_95: IC2.95(PF2_(ADC2)) P15.3
NetIC2_96: IC2.96(PF1_(ADC1)) P15.2
NetIC2_97: IC2.97(PF0_(ADC0)) P15.1
NetJTAG_1: JTAG.1 Rp2.1
NetJTAG_2: JTAG.2 Rp2.2
NetJTAG_3: JTAG.3 Rp2.3
NetJTAG_4: JTAG.4 Rp2.4
NetL2_A: L2.A R6.2
NetM1_1: M1.1(AO1) M1.2(AO1) P8.1
NetM1_5: M1.5(AO2) M1.6(AO2) P8.2
NetM1_7: M1.7(BO2) M1.8(BO2) P10.2
NetM1_11: M1.11(BO1) M1.12(BO1) P10.1
NetM2_1: M2.1(AO1) M2.2(AO1) P9.1
NetM2_5: M2.5(AO2) M2.6(AO2) P9.2
NetM2_7: M2.7(BO2) M2.8(BO2) P11.2
NetM2_11: M2.11(BO1) M2.12(BO1) P11.1
NetON1_A: ON1.A R3.2
NetP2_1: P2.1 U12.5(DIO12)
NetP2_2: P2.2 U12.24(DIO4)
NetP2_4: P2.4 U12.30(AD3/DIO3)
NetP2_5: P2.5 U12.31(AD2/DIO2)
NetP2_6: P2.6 U12.32(AD1/DIO1)
NetP2_7: P2.7 U12.33(AD0/DIO0)
NetP6_1: P6.1 P12.1 U15.38(OUTA1) U15.42(OUTA1) U15.53(OUTA1) U15.93(OUTA1)
NetP6_2: P6.2 P12.2 U15.65(OUTB1) U15.76(OUTB1) U15.80(OUTB1) U15.96(OUTB1)
NetP6_3: P6.3 P12.3 U15.22(OUTA2) U15.33(OUTA2) U15.37(OUTA2) U15.92(OUTA2)
NetP6_4: P6.4 P12.4 U15.7(OUTB2) U15.81(OUTB2) U15.85(OUTB2) U15.97(OUTB2)
NetP23_4: P23.4 U11.4(SENSOR_VP)
NetP23_5: P23.5 U11.5(SENSOR_VN)
NetP23_6: P23.6 U11.32(NC)
NetPIN-OUT_1: PIN-OUT.1 U11.7(IO35)
NetPIN-OUT_2: PIN-OUT.2 U11.6(IO34)
NetPIN-OUT_3: PIN-OUT.3 U11.9(IO33)
NetPIN-OUT_4: PIN-OUT.4 U11.8(IO32)
NetPIN-OUT_5: PIN-OUT.5 U11.12(IO27)
NetPIN-OUT_6: PIN-OUT.6 U11.11(IO26)
NetPIN-OUT_7: PIN-OUT.7 U11.10(IO25)
NetPIN-OUT_8: PIN-OUT.8 U11.37(IO23)
NetPIN-OUT_9: PIN-OUT.9 U11.36(IO22)
NetPIN-OUT_10: PIN-OUT.10 U11.33(IO21)
NetPIN-OUT_11: PIN-OUT.11 U11.31(IO19)
NetPIN-OUT_12: PIN-OUT.12 U11.30(IO18)
NetPIN-OUT_13: PIN-OUT.13 U11.28(IO17)
NetPIN-OUT_14: PIN-OUT.14 U11.27(IO16)
NetPIN-OUT_19: PIN-OUT.19 U11.29(IO5)
NetPIN-OUT_20: PIN-OUT.20 U11.26(IO4)
NetPIN-OUT_21: PIN-OUT.21 U11.24(IO2)
NetQ2_1: Q2.1(B) R18.2
NetQ3_1: Q3.1(B) R19.2
NetR6_1: R6.1 U1.1(OUT) U1.2(IN-)
NetRp1_7: Rp1.7 TX1.A
NetRp1_8: Rp1.8 RX1.A
NetSW3_2: SW3.2 U15.18(SW)
NetU2_2: U2.2(DOUT) U3.4(DIN)
NetU3_2: U3.2(DOUT) U4.4(DIN)
NetU4_2: U4.2(DOUT) U5.4(DIN)
NetU5_2: U5.2(DOUT) U6.4(DIN)
NetU6_2: U6.2(DOUT) U7.4(DIN)
NetU7_2: U7.2(DOUT) U8.4(DIN)
NetU8_2: U8.2(DOUT) U9.4(DIN)
NetU9_2: U9.2(DOUT) U10.4(DIN)

Not connected (* = marked no-connect by the designer): Camera 6; CP2104 1(~{RI}) 10(NC)* 11(GPIO.3) 12(GPIO.2) 13(GPIO.1) 14(GPIO.0) 15(~{SUSPEND}) 17(SUSPEND) 18(~{CTS}) 22(~{DSR}) 24(~{DCD}); IC3 4(BYPASS); IC4 5(PC2_(PCINT11/AIN2)) 6(PD0_(OC.0B/INT0)) 7(PD1_(AIN0/INT1)) 12(PD6_(~{RTS}/AIN5/INT6)) 14(PB0_(~{SS}/PCINT0)) 18(PB4_(T1/PCINT4)) 19(PB5_(PCINT5)) 20(PB6_(PCINT6)) 21(PB7_(PCINT7/OC.0A/OC.1C)) 22(PC7_(INT4/ICP1/CLKO)) 23(PC6_(OC.1A/PCINT8)) 25(PC5_(PCINT9/OC.1B)) 26(PC4_(PCINT10)); J1 4(ID); J2 A2(SSTXp1) A3(SSTXn1) A5(CC1) A8(SBU1) A10(SSRXn2) A11(SSRXp2) B2(SSTXp2) B3(SSTXn2) B5(CC2) B8(SBU2) B10(SSRXn1) B11(SSRXp1); J3 4(ID); J4 A2(SSTXp1) A3(SSTXn1) A5(CC1) A8(SBU1) A10(SSRXn2) A11(SSRXp2) B2(SSTXp2) B3(SSTXn2) B5(CC2) B8(SBU2) B10(SSRXn1) B11(SSRXp1); P2 3; P5 1 2 3 4 5 6 MP1 MP2; P8 MP1 MP2; P9 MP1 MP2; P10 MP1 MP2; P11 MP1 MP2; P15 9; P18 9; TEST-HEADER1 1; U10 2(DOUT); U12 6(~{RESET}) 7(RSSI_PWM/DIO10) 8(PWM1/DIO11) 9(RESERVED) 10(~{DTR}/SLEEP_RQ/DIO8) 12(SPI_~{ATTN}/~{BOOTMODE}/DIO19) 14(SPI_CLK/DIO18) 15(SPI_~{SSEL}/DIO17) 16(SPI_MOSI/DIO16) 17(SPI_MISO/DIO15) 18(RESERVED) 19(RESERVED) 20(RESERVED) 21(RESERVED) 23(RESERVED) 25(~{CTS}/DIO7) 26(ON/~{SLEEP}/DIO9) 27(VREF) 28(ASSOCIATE/DIO5) 29(~{RTS}/DIO6) 34(RESERVED) 36(RF) 37(RESERVED); U15 63(OSCIN) 64(OSCOUT)

## Notes on the sheet
- ATmega2560-16AU AND ESP-WROOM-32 Communication Port
- ZHANG TINGLIANG 张庭梁